# EAGLE design Breakouts0 (EAGLE 6.5.0)
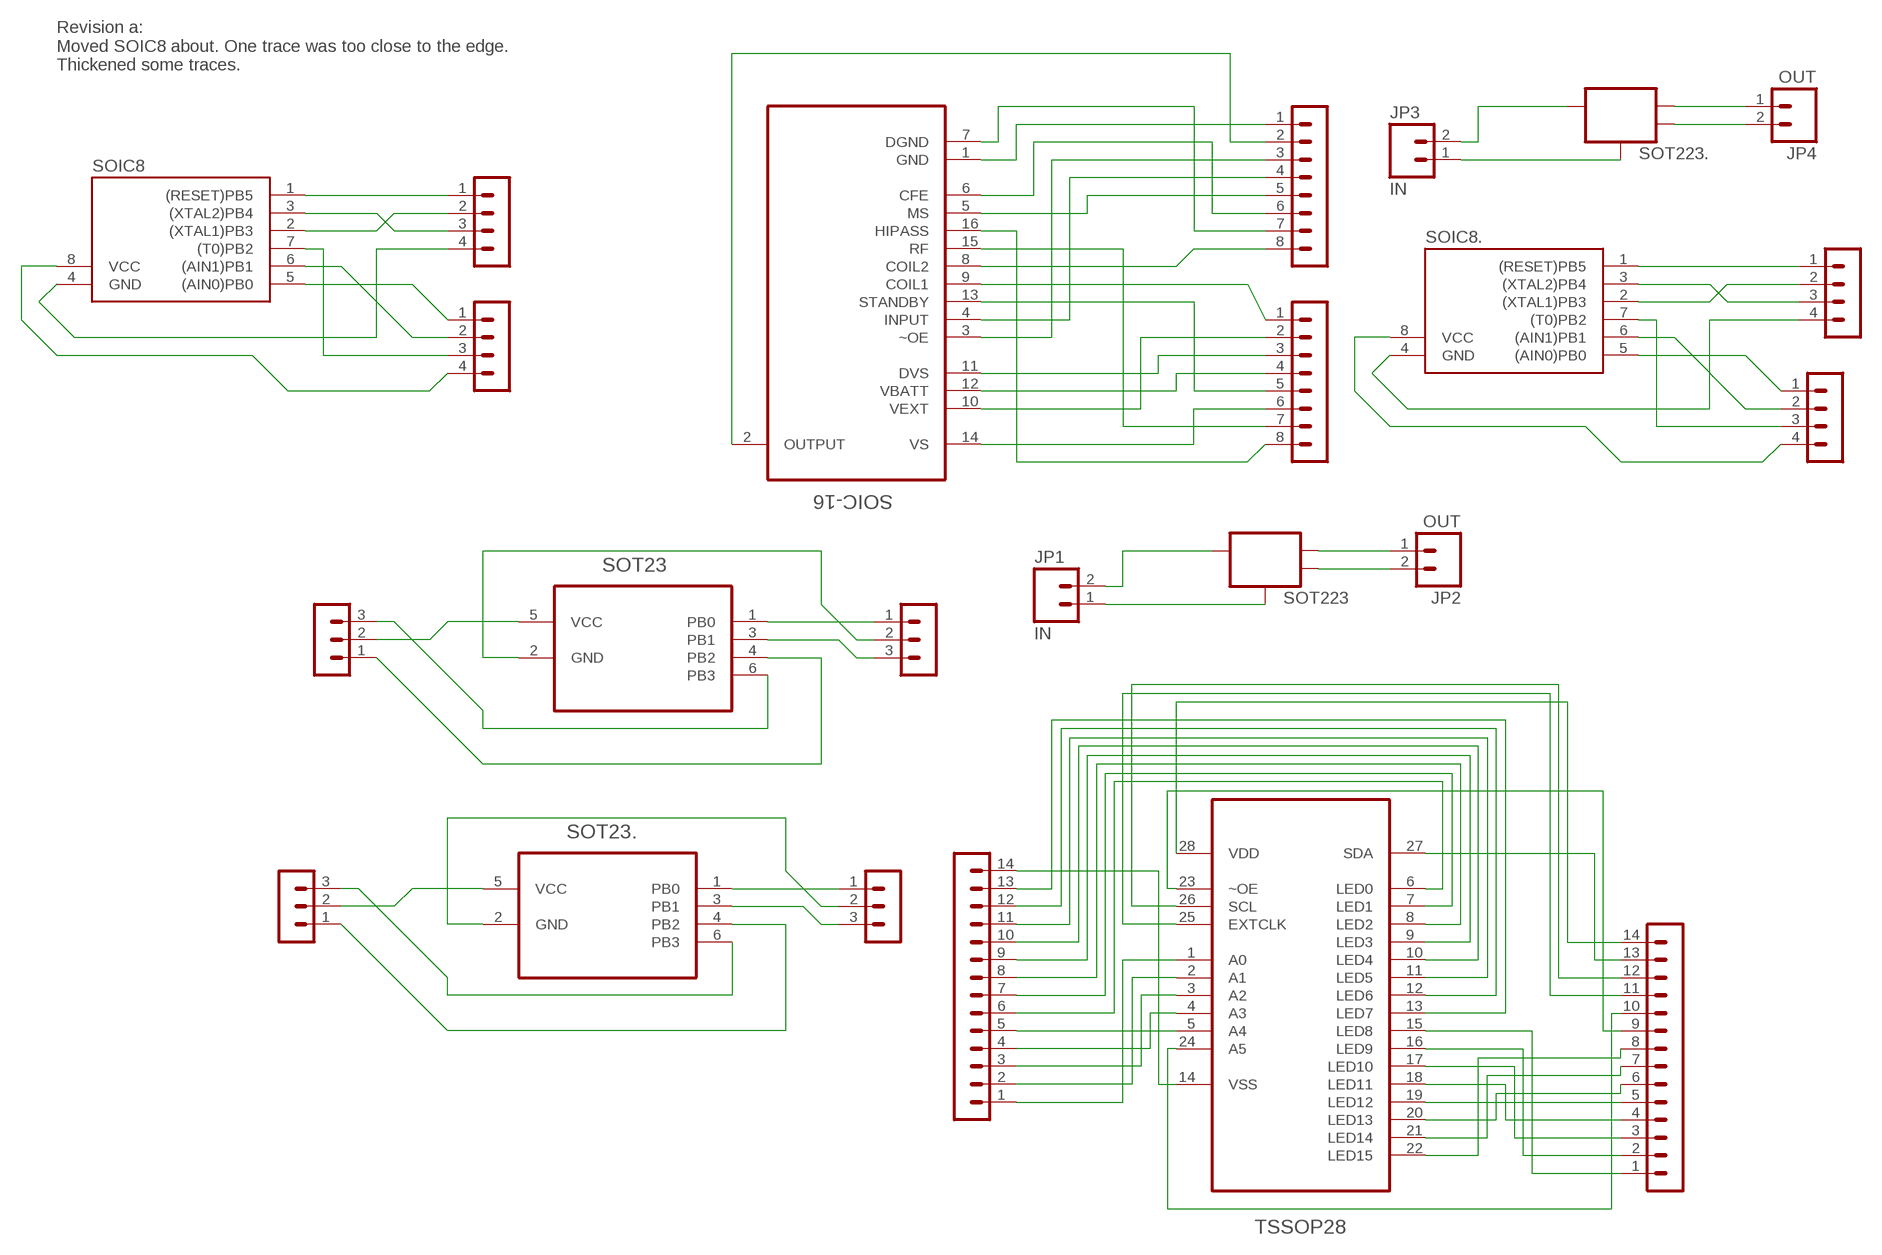
[diagram p0: schematic, sheet 1]

## Parts
JP1  IN  M02PTH  [1X02]
JP2  OUT  M02PTH  [1X02]
JP3  IN  M02PTH  [1X02]
JP4  OUT  M02PTH  [1X02]
SOIC8  TINY10S  [SOIC8]
SOIC8.  TINY10S  [SOIC8]
SOIC-16  U2270B-MFPY  [SOIC127P600X140-16N]
SOT23  ATTINY10-TSHR  [SOT95P280X145-6N]
SOT23.  ATTINY10-TSHR  [SOT95P280X145-6N]
SOT223  SOT223SOT223  [SOT223]
SOT223.  SOT223SOT223  [SOT223]
SV1  MA08-1  [MA08-1]
SV2  MA08-1  [MA08-1]
SV3  MA03-1  [MA03-1]
SV4  MA03-1  [MA03-1]
SV5  MA14-1  [MA14-1]
SV8  MA04-1  [MA04-1]
SV9  MA14-1  [MA14-1]
SV10  MA04-1  [MA04-1]
SV13  MA04-1  [MA04-1]
SV14  MA04-1  [MA04-1]
SV21  MA03-1  [MA03-1]
SV22  MA03-1  [MA03-1]
TSSOP28  PCA9685PW  [SOP65P640X110-28N]

## Nets
N$1: SOT23..1(PB0) SV4.1
N$2: SOT23..2(GND) SV4.2
N$3: SOT23..3(PB1) SV4.3
N$4: SOT23..4(PB2) SV3.1
N$5: SOT23..5(VCC) SV3.2
N$6: SOT23..6(PB3) SV3.3
N$13: JP3.2 SOT223..3(IN)
N$14: JP3.1 SOT223..1(ADJ)
N$15: JP4.1 SOT223..2(OUT)
N$16: JP4.2 SOT223..4(OUT)
N$17: SOIC8..1((RESET)PB5) SV8.1
N$18: SOIC8..2((XTAL1)PB3) SV8.2
N$19: SOIC8..3((XTAL2)PB4) SV8.3
N$20: SOIC8..4(GND) SV8.4
N$21: SOIC8..5((AIN0)PB0) SV10.1
N$22: SOIC8..6((AIN1)PB1) SV10.2
N$23: SOIC8..7((T0)PB2) SV10.3
N$24: SOIC8..8(VCC) SV10.4
N$25: SOIC8.1((RESET)PB5) SV13.1
N$26: SOIC8.2((XTAL1)PB3) SV13.2
N$27: SOIC8.3((XTAL2)PB4) SV13.3
N$28: SOIC8.4(GND) SV13.4
N$29: SOIC8.5((AIN0)PB0) SV14.1
N$30: SOIC8.6((AIN1)PB1) SV14.2
N$31: SOIC8.7((T0)PB2) SV14.3
N$32: SOIC8.8(VCC) SV14.4
N$105: SOIC-16.1(GND) SV1.1
N$106: SOIC-16.2(OUTPUT) SV1.2
N$107: SOIC-16.3(~OE) SV1.3
N$108: SOIC-16.4(INPUT) SV1.4
N$109: SOIC-16.5(MS) SV1.5
N$110: SOIC-16.6(CFE) SV1.6
N$111: SOIC-16.7(DGND) SV1.7
N$112: SOIC-16.8(COIL2) SV1.8
N$113: SOIC-16.9(COIL1) SV2.1
N$114: SOIC-16.10(VEXT) SV2.2
N$115: SOIC-16.11(DVS) SV2.3
N$116: SOIC-16.12(VBATT) SV2.4
N$117: SOIC-16.13(STANDBY) SV2.5
N$118: SOIC-16.14(VS) SV2.6
N$119: SOIC-16.15(RF) SV2.7
N$120: SOIC-16.16(HIPASS) SV2.8
N$121: SOT23.1(PB0) SV22.1
N$122: SOT23.2(GND) SV22.2
N$123: SOT23.3(PB1) SV22.3
N$124: SOT23.4(PB2) SV21.1
N$125: SOT23.5(VCC) SV21.2
N$126: SOT23.6(PB3) SV21.3
N$127: JP1.2 SOT223.3(IN)
N$128: JP2.1 SOT223.2(OUT)
N$129: JP2.2 SOT223.4(OUT)
N$130: SV5.1 TSSOP28.1(A0)
N$131: SV5.14 TSSOP28.14(VSS)
N$132: SV9.1 TSSOP28.15(LED8)
N$133: SV9.14 TSSOP28.28(VDD)
N$134: SV5.2 TSSOP28.2(A1)
N$135: SV5.3 TSSOP28.3(A2)
N$136: SV5.4 TSSOP28.4(A3)
N$137: SV5.5 TSSOP28.5(A4)
N$138: SV5.6 TSSOP28.6(LED0)
N$139: SV5.7 TSSOP28.7(LED1)
N$140: SV5.8 TSSOP28.8(LED2)
N$141: SV5.9 TSSOP28.9(LED3)
N$142: SV5.10 TSSOP28.10(LED4)
N$143: SV5.11 TSSOP28.11(LED5)
N$144: SV5.12 TSSOP28.12(LED6)
N$145: SV5.13 TSSOP28.13(LED7)
N$146: SV9.2 TSSOP28.16(LED9)
N$147: SV9.3 TSSOP28.17(LED10)
N$148: SV9.4 TSSOP28.18(LED11)
N$149: SV9.5 TSSOP28.19(LED12)
N$150: SV9.6 TSSOP28.20(LED13)
N$151: SV9.7 TSSOP28.21(LED14)
N$152: SV9.8 TSSOP28.22(LED15)
N$153: SV9.10 TSSOP28.24(A5)
N$154: SV9.9 TSSOP28.23(~OE)
N$155: SV9.11 TSSOP28.25(EXTCLK)
N$156: SV9.12 TSSOP28.26(SCL)
N$157: SV9.13 TSSOP28.27(SDA)
N$158: JP1.1 SOT223.1(ADJ)

## Notes on the sheet
- Revision a:
  Moved SOIC8 about. One trace was too close to the edge.
  Thickened some traces.

## Library data of the parts
JP1-JP4 = SparkFun-Connectors:M02: Header 2 Standard 2-pin 0.1" header. Use with straight break away headers (SKU : PRT-00116), right angle break away headers (PRT-00553), swiss pins (PRT-00743), machine pins (PRT-00117), and female headers (PRT-00115). Molex polarized connector foot print use with SKU : PRT-08233 with associated crimp pins and housings.
SOIC8 SOIC8. = atmel:TINY10: MICROCONTROLLER 1 Kbytes ROM; OC_FARNELL: unknown; OC_NEWARK: unknown
SOIC-16 = Atmel_By_element14_Batch_1:U2270B-MFPY: Read/Write Base Station; MPN: U2270B-MFPY; OC_FARNELL: 1095806; OC_NEWARK: 93K1097; PACKAGE: SOIC-16; SUPPLIER: ATMEL
SOT23 SOT23. = Atmel_By_element14_Batch_1:ATTINY10-TSHR: 8-bit Microcontroller with In-System Programmable Flash; MPN: ATTINY10-TSHR; OC_FARNELL: 1748538; OC_NEWARK: 26R5645; PACKAGE: SOT-23-6; SUPPLIER: Atmel
SOT223 SOT223. = SMD Pads:SOT223: Voltage Regulator LM1117 Standard adjustable voltage regulator but in SMD form. Spark Fun Electronics SKU : COM-00595
SV1 SV2 = SMD Pads:MA08-1: PIN HEADER; OC_FARNELL: unknown; OC_NEWARK: unknown
SV3 SV4 SV21 SV22 = SMD Pads:MA03-1: PIN HEADER; OC_FARNELL: unknown; OC_NEWARK: unknown
SV5 SV9 = SMD Pads:MA14-1: PIN HEADER; OC_FARNELL: unknown; OC_NEWARK: unknown
SV8 SV10 SV13 SV14 = SMD Pads:MA04-1: PIN HEADER; OC_FARNELL: unknown; OC_NEWARK: unknown
TSSOP28 = Xmas Lights:PCA9685PW: 16-channel, 12-bit PWM Fm+ I2C-bus LED controller; MPN: PCA9685PW; OC_FARNELL: 1854074; OC_NEWARK: 19T6398; PACKAGE: TSSOP-28; SUPPLIER: NXP

## Board
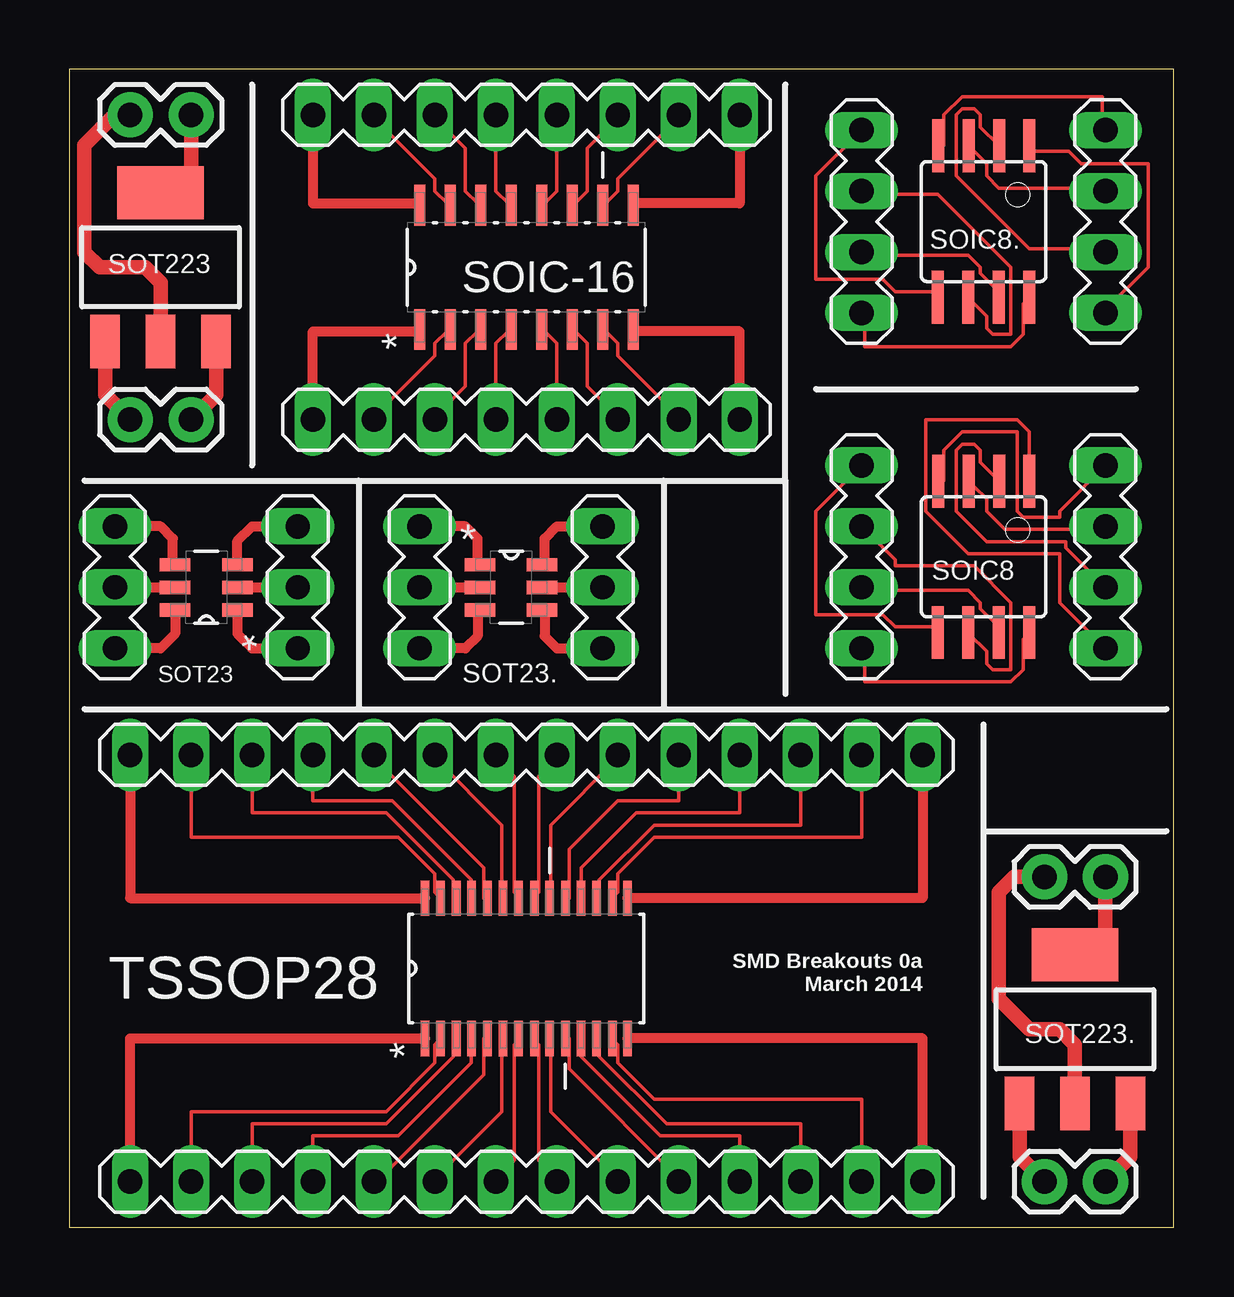
[diagram p1: board, top side]
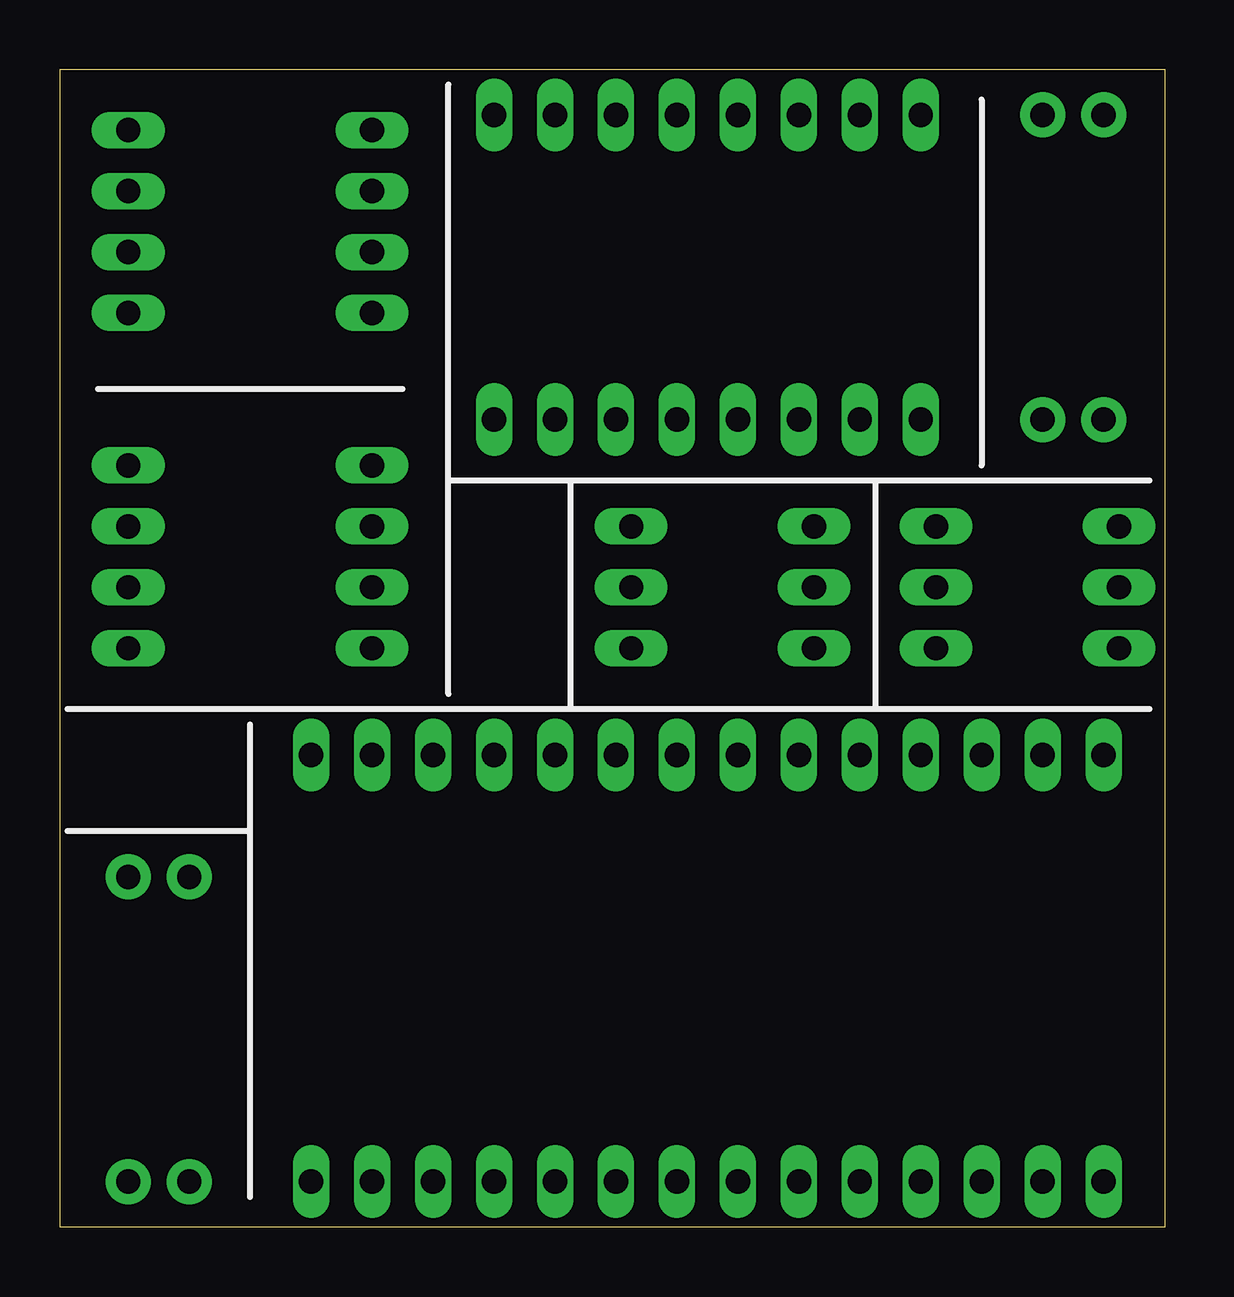
[diagram p2: board, bottom side, seen from below]

Size 46.02 x 48.25 mm. Coordinates in mm from the lower left corner, seen from the top.
Outline: 0,0 46.02,0 46.02,48.25 0,48.25 0,0
Copper layers (1*16): Top 0.035mm / dielectric 1.5mm / Bottom 0.035mm
Design rules "Seeed Fusion_eagle_rule_v1.1": minimum track width 6mil, minimum drill 12mil, track to track 6mil, track to pad 6mil, pad to pad 6mil, via to via 6mil, smd to smd 0mil, copper to edge 10mil, drill to drill 10mil, minimum pad ring 10mil, minimum via ring 6mil, stop-mask expansion 2mil, vias tented up to drill 100mil, thermal gap 10mil

### Footprints (pad centres in the part's own frame; a part is rotated, then mirrored left to right if it is on the bottom)
1X02 = drill 1.016 pad 1.88: 1 0,0; 2 2.54,0
SOIC8 = smd 0.5 x 2.2: 1 -1.905,-3.154; 2 -0.645,-3.154; 3 0.625,-3.154; 4 1.895,-3.154; 5 1.905,3.154; 6 0.635,3.154; 7 -0.635,3.154; 8 -1.905,3.154
SOIC127P600X140-16N = smd 1.702 x 0.457: 1 -2.591,4.445; 2 -2.591,3.175; 3 -2.591,1.905; 4 -2.591,0.635; 5 -2.591,-0.635; 6 -2.591,-1.905; 7 -2.591,-3.175; 8 -2.591,-4.445; 9 2.591,-4.445; 10 2.591,-3.175; 11 2.591,-1.905; 12 2.591,-0.635; 13 2.591,0.635; 14 2.591,1.905; 15 2.591,3.175; 16 2.591,4.445
SOT95P280X145-6N = smd 1.27 x 0.559: 1 -1.295,0.94; 2 -1.295,0; 3 -1.295,-0.94; 4 1.295,-0.94; 5 1.295,0; 6 1.295,0.94
SOT223 = smd 1.219 x 2.235: 1 -2.311,-3.099; 2 0,-3.099; 3 2.311,-3.099 | smd 3.6 x 2.2: 4 0,3.099
MA08-1 = drill 1.016 long: 1 -8.89,0; 2 -6.35,0; 3 -3.81,0; 4 -1.27,0; 5 1.27,0; 6 3.81,0; 7 6.35,0; 8 8.89,0
MA03-1 = drill 1.016 long: 1 -2.54,0; 2 0,0; 3 2.54,0
MA14-1 = drill 1.016 long: 1 -16.51,0; 2 -13.97,0; 3 -11.43,0; 4 -8.89,0; 5 -6.35,0; 6 -3.81,0; 7 -1.27,0; 8 1.27,0; 9 3.81,0; 10 6.35,0; 11 8.89,0; 12 11.43,0; 13 13.97,0; 14 16.51,0
MA04-1 = drill 1.016 long: 1 -3.81,0; 2 -1.27,0; 3 1.27,0; 4 3.81,0
SOP65P640X110-28N = smd 1.473 x 0.356: 1 -2.921,4.216; 2 -2.921,3.581; 3 -2.921,2.921; 4 -2.921,2.286; 5 -2.921,1.626; 6 -2.921,0.965; 7 -2.921,0.33; 8 -2.921,-0.33; 9 -2.921,-0.965; 10 -2.921,-1.626; 11 -2.921,-2.286; 12 -2.921,-2.921; 13 -2.921,-3.581; 14 -2.921,-4.216; 15 2.921,-4.216; 16 2.921,-3.581; 17 2.921,-2.921; 18 2.921,-2.286; 19 2.921,-1.626; 20 2.921,-0.965; 21 2.921,-0.33; 22 2.921,0.33; 23 2.921,0.965; 24 2.921,1.626; 25 2.921,2.286; 26 2.921,2.921; 27 2.921,3.581; 28 2.921,4.216

### Placement (x,y rotation side)
JP1  2.54,33.66 0 top
JP2  2.54,46.35 0 top
JP3  40.64,1.91 0 top
JP4  40.64,14.61 0 top
SOIC8  38.1,27.94 180 top
SOIC8.  38.1,41.91 180 top
SOIC-16  19.05,40.01 90 top
SOT23  5.71,26.67 180 top
SOT23.  18.41,26.67 0 top
SOT223  3.81,40.01 0 top
SOT223.  41.91,8.26 0 top
SV1  19.05,33.66 0 top
SV2  19.05,46.35 180 top
SV3  22.23,26.67 90 top
SV4  14.61,26.67 270 top
SV5  19.05,1.91 0 top
SV8  43.18,41.91 90 top
SV9  19.05,19.68 180 top
SV10  33.02,41.91 270 top
SV13  43.18,27.94 90 top
SV14  33.02,27.94 270 top
SV21  1.91,26.67 270 top
SV22  9.53,26.67 90 top
TSSOP28  19.05,10.79 90 top

### Tracks (layer width: path | path; a pad name or v marks a point on that pad's centre or on a via)
N$1
  Top 0.152: 17.02,27.69 SOT23..1 | 14.73,29.21 SV4.1
  Top 0.406: 17.02,27.69 17.02,28.7 16.51,29.21 SV4.1
N$2
  Top 0.406: SV4.2 SOT23..2
N$3
  Top 0.152: 17.02,25.65 SOT23..3 | 14.73,24.13 SV4.3
  Top 0.406: 17.02,25.65 17.02,24.64 16.51,24.13 SV4.3
N$4
  Top 0.152: 19.81,25.65 SOT23..4 | 22.1,24.13 SV3.1
  Top 0.406: 19.81,25.65 19.81,24.64 20.32,24.13 SV3.1
N$5
  Top 0.406: SOT23..5 SV3.2
N$6
  Top 0.152: 19.81,27.69 SOT23..6 | 22.1,29.21 SV3.3
  Top 0.406: 19.81,27.69 19.81,28.7 20.32,29.21 SV3.3
N$13
  Top 0.61: SOT223..3 44.22,2.95 JP3.2
N$14
  Top 0.61: SOT223..1 39.6,2.95 JP3.1
N$15
  Top 0.61: JP4.1 39.37,14.61 38.73,13.97 38.73,9.53 40.01,8.26 41.27,8.26 41.91,7.62 SOT223..2
N$16
  Top 0.152: 43.18,11.43 41.91,11.43 SOT223..4
  Top 0.61: JP4.2 43.18,11.43
N$17
  Top 0.152: SOIC8..1 40.13,44.83 41.66,44.83 42.16,44.32 44.96,44.32 44.96,40.01 43.18,38.23 SV8.1
N$18
  Top 0.152: SOIC8..2 38.73,45.09 37.97,45.85 37.97,46.35 37.72,46.61 37.21,46.61 36.96,46.35 36.96,43.81 40.01,40.77 43.05,40.77 SV8.2
N$19
  Top 0.152: SOIC8..3 37.72,44.83 38.23,44.32 38.23,43.81 38.73,43.31 43.05,43.31 SV8.3
N$20
  Top 0.152: SOIC8..4 36.45,45.09 36.45,46.35 37.21,47.12 43.05,47.12 43.05,45.85 SV8.4
N$21
  Top 0.152: SV10.1 31.11,43.81 31.11,39.5 33.91,39.5 34.42,38.99 36.2,38.99 SOIC8..5
N$22
  Top 0.152: SOIC8..6 37.47,38.73 38.23,37.97 38.23,37.47 38.48,37.21 39.24,37.21 39.24,40.01 36.2,43.05 33.15,43.05 SV10.2
N$23
  Top 0.152: SOIC8..7 38.73,38.99 37.97,39.75 37.97,40.01 37.47,40.51 33.15,40.51 SV10.3
N$24
  Top 0.152: SOIC8..8 40.01,38.73 39.75,38.48 39.75,37.21 39.24,36.7 33.15,36.7 33.15,37.97 SV10.4
N$25
  Top 0.152: SOIC8.1 40.01,33.15 39.5,33.66 35.69,33.66 35.69,29.84 37.47,28.07 41.27,28.07 41.27,26.04 SV13.1
N$26
  Top 0.152: SV13.2 41.53,28.32 41.53,28.57 38.23,28.57 36.96,29.84 36.96,32.38 37.21,32.64 37.72,32.64 37.97,32.38 37.97,31.88 38.73,31.11 SOIC8.2
N$27
  Top 0.152: SOIC8.3 37.72,30.86 38.23,30.35 38.23,29.84 38.99,29.08 43.05,29.08 SV13.3
N$28
  Top 0.152: SV13.4 41.27,29.84 41.27,29.59 39.75,29.59 39.5,29.84 39.5,33.15 37.21,33.15 36.45,32.38 36.45,31.11 SOIC8.4
N$29
  Top 0.152: SV14.1 31.11,29.84 31.11,25.53 33.91,25.53 34.42,25.02 36.2,25.02 SOIC8.5
N$30
  Top 0.152: SV14.2 34.42,27.81 34.42,27.56 37.72,27.56 39.24,26.04 39.24,23.24 38.48,23.24 38.23,23.5 38.23,24 37.47,24.77 SOIC8.6
N$31
  Top 0.152: SOIC8.7 38.73,25.02 37.97,25.78 37.97,26.04 37.47,26.54 33.15,26.54 SV14.3
N$32
  Top 0.152: SOIC8.8 40.01,24.77 39.75,24.51 39.75,23.24 39.24,22.73 33.15,22.73 33.15,24 SV14.4
N$105
  Top 0.152: 14.48,37.34 SOIC-16.1
  Top 0.406: 14.48,37.34 10.16,37.34 SV1.1
N$106
  Top 0.152: SOIC-16.2 15.75,37.34 15.24,36.83 15.24,36.32 12.7,33.78 SV1.2
N$107
  Top 0.152: SOIC-16.3 17.02,37.34 16.51,36.83 16.51,35.05 15.24,33.78 SV1.3
N$108
  Top 0.152: SV1.4 17.78,36.83 18.29,37.34 SOIC-16.4
N$109
  Top 0.152: SV1.5 20.32,36.83 19.81,37.34 SOIC-16.5
N$110
  Top 0.152: SOIC-16.6 21.08,37.34 21.59,36.83 21.59,35.05 22.86,33.78 SV1.6
N$111
  Top 0.152: SOIC-16.7 22.35,37.34 22.86,36.83 22.86,36.32 25.4,33.78 SV1.7
N$112
  Top 0.152: 23.62,37.34 SOIC-16.8
  Top 0.406: 23.62,37.34 27.94,37.34 SV1.8
N$113
  Top 0.152: 23.62,42.67 SOIC-16.9
  Top 0.406: 23.62,42.67 27.94,42.67 SV2.1
N$114
  Top 0.152: SOIC-16.10 22.35,42.67 22.86,43.18 22.86,43.69 25.4,46.23 SV2.2
N$115
  Top 0.152: SOIC-16.11 21.08,42.67 21.59,43.18 21.59,44.96 22.86,46.23 SV2.3
N$116
  Top 0.152: SV2.4 20.32,43.18 19.81,42.67 SOIC-16.12
N$117
  Top 0.152: SV2.5 17.78,43.18 18.29,42.67 SOIC-16.13
N$118
  Top 0.152: SOIC-16.14 17.02,42.67 16.51,43.18 16.51,44.96 15.24,46.23 SV2.6
N$119
  Top 0.152: SOIC-16.15 15.75,42.67 15.24,43.18 15.24,43.69 12.7,46.23 SV2.7
N$120
  Top 0.152: 14.48,42.67 SOIC-16.16
  Top 0.406: 14.48,42.67 10.16,42.67 SV2.8
N$121
  Top 0.406: SOT23.1 7.01,24.74 7.62,24.13 SV22.1
N$122
  Top 0.406: SOT23.2 SV22.2
N$123
  Top 0.406: SOT23.3 7.01,28.6 7.62,29.21 SV22.3
N$124
  Top 0.152: 4.32,27.69 SOT23.4 | 2.03,29.21 SV21.1
  Top 0.406: 4.32,27.69 4.32,28.7 3.81,29.21 SV21.1
N$125
  Top 0.406: SV21.2 SOT23.5
N$126
  Top 0.406: SOT23.6 4.42,24.74 3.81,24.13 SV21.3
N$127
  Top 0.61: SOT223.3 6.12,34.7 JP1.2
N$128
  Top 0.61: JP2.1 1.91,46.35 0.64,45.09 0.64,40.64 1.27,40.01 3.17,40.01 3.81,39.37 SOT223.2
N$129
  Top 0.152: 5.08,43.18 3.81,43.18 SOT223.4
  Top 0.61: JP2.2 5.08,43.18
N$130
  Top 0.406: TSSOP28.1 2.54,7.87 SV5.1
N$131
  Top 0.406: TSSOP28.14 35.56,7.87 SV5.14
N$132
  Top 0.406: TSSOP28.15 35.56,13.72 SV9.1
N$133
  Top 0.406: TSSOP28.28 2.54,13.72 SV9.14
N$134
  Top 0.152: SV5.2 5.08,4.83 13.21,4.83 15.24,6.86 15.24,7.62 15.49,7.87 TSSOP28.2
N$135
  Top 0.152: SV5.3 7.62,4.32 13.21,4.32 16,7.11 16,7.87 TSSOP28.3
N$136
  Top 0.152: TSSOP28.4 16.76,6.86 13.72,3.81 10.16,3.81 SV5.4
N$137
  Top 0.152: TSSOP28.5 17.27,7.87 17.27,6.35 12.7,1.78 SV5.5
N$138
  Top 0.152: TSSOP28.6 18.03,7.87 18.03,4.83 15.24,2.03 SV5.6
N$139
  Top 0.152: TSSOP28.7 18.8,7.87 18.54,7.62 18.54,2.79 17.78,2.03 SV5.7
N$140
  Top 0.152: TSSOP28.8 19.3,7.87 19.56,7.62 19.56,2.79 20.32,2.03 SV5.8
N$141
  Top 0.152: TSSOP28.9 20.07,7.87 20.07,4.83 22.86,2.03 SV5.9
N$142
  Top 0.152: TSSOP28.10 20.83,7.87 20.83,6.6 25.4,2.03 SV5.10
N$143
  Top 0.152: TSSOP28.11 21.34,7.11 24.64,3.81 27.94,3.81 SV5.11
N$144
  Top 0.152: SV5.12 30.48,4.32 24.89,4.32 22.1,7.11 22.1,7.87 TSSOP28.12
N$145
  Top 0.152: SV5.13 33.02,5.33 24.38,5.33 22.86,6.86 22.86,7.62 22.61,7.87 TSSOP28.13
N$146
  Top 0.152: SV9.2 33.02,16.26 24.38,16.26 22.86,14.73 22.86,13.97 22.61,13.72 TSSOP28.16
N$147
  Top 0.152: SV9.3 30.48,16.76 24.38,16.76 22.1,14.48 22.1,13.72 TSSOP28.17
N$148
  Top 0.152: TSSOP28.18 21.34,14.99 23.62,17.27 27.94,17.27 SV9.4
N$149
  Top 0.152: SV9.5 25.4,17.78 22.86,17.78 20.83,15.75 20.83,13.72 TSSOP28.19
N$150
  Top 0.152: TSSOP28.20 20.07,13.72 20.07,16.76 22.86,19.56 SV9.6
N$151
  Top 0.152: TSSOP28.21 19.3,13.72 19.56,13.97 19.56,18.8 20.32,19.56 SV9.7
N$152
  Top 0.152: TSSOP28.22 18.8,13.72 18.54,13.97 18.54,18.8 17.78,19.56 SV9.8
N$153
  Top 0.152: TSSOP28.24 17.27,13.72 17.27,14.99 12.7,19.56 SV9.10
N$154
  Top 0.152: TSSOP28.23 18.03,13.72 18.03,16.76 15.24,19.56 SV9.9
N$155
  Top 0.152: TSSOP28.25 16.76,14.48 13.46,17.78 10.16,17.78 SV9.11
N$156
  Top 0.152: SV9.12 7.62,17.27 13.21,17.27 16,14.48 16,13.72 TSSOP28.26
N$157
  Top 0.152: SV9.13 5.08,16.26 13.72,16.26 15.24,14.73 15.24,13.97 15.49,13.72 TSSOP28.27
N$158
  Top 0.61: SOT223.1 1.5,34.7 JP1.1

### Text on the board
tPlace: SMD Breakouts 0a / March 2014